# EAGLE design JouleThief-PCBCOIL (EAGLE 7.6.0)
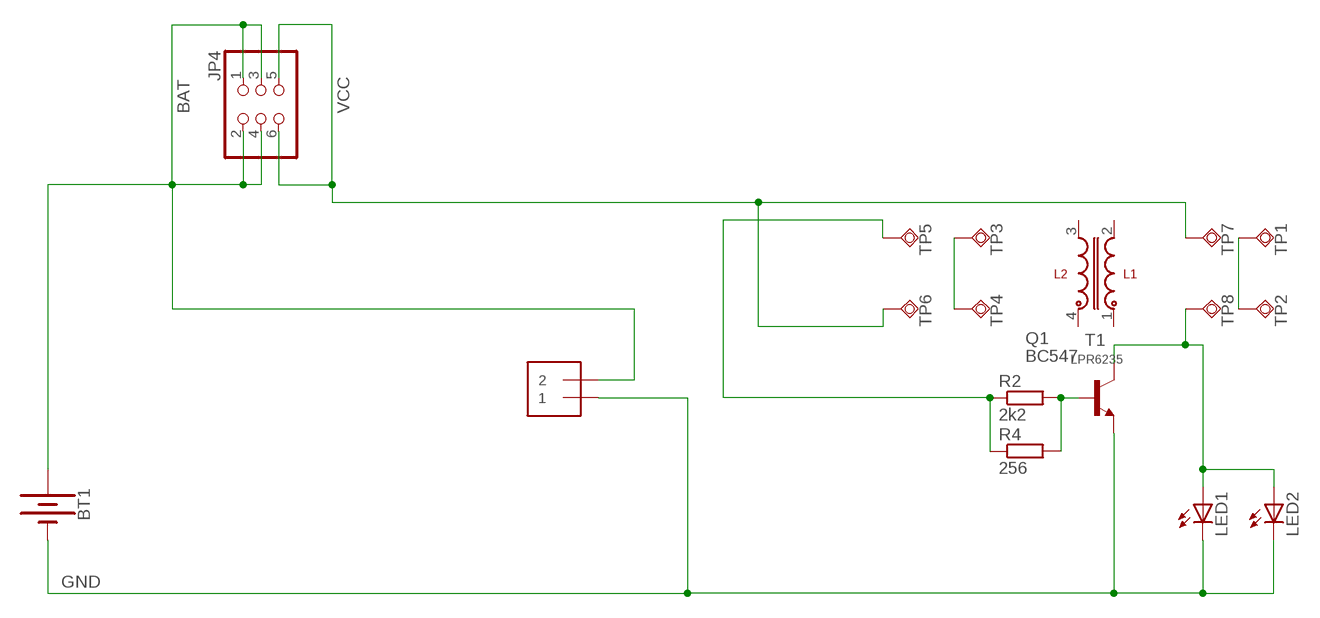
[diagram p0: schematic, sheet 1]

## Parts
BT1  BATTERY-AAA_KIT  [BATTERY-AAA-KIT]
J1  1X2-3.5MM  [1X2-3.5MM]
JP4  PINHD-2X3  [2X03]
LED1  LEDKA-3528ASYC  [KA-3528ASYC]
LED2  LED5MM  [LED5MM]
Q1  BC547  [TO92]
R2  2k2  R-EU_0204/5  [0204/5@1]
R4  256  R-EU_R0603  [R0603]
T1  LPR6235  [LPR6235]
TP1  TPSQTP07R  [TP07R]
TP2  TPSQTP07R  [TP07R]
TP3  TPSQTP07R  [TP07R]
TP4  TPSQTP07R  [TP07R]
TP5  TPSQTP07R  [TP07R]
TP6  TPSQTP07R  [TP07R]
TP7  TPSQTP07R  [TP07R]
TP8  TPSQTP07R  [TP07R]

## Nets
BAT: BT1.PWR@1(+) J1.2 JP4.1 JP4.2 JP4.3 JP4.4
GND: BT1.GND@1(-) J1.1 LED1.C LED2.K(C) Q1.1(E)
N$1: R2.1 R4.1 TP5.TP
N$2: Q1.2(B) R2.2 R4.2
N$3: LED1.A LED2.A Q1.3(C) TP8.TP
N$4: TP3.TP TP4.TP
N$5: TP1.TP TP2.TP
VCC: JP4.5 JP4.6 TP6.TP TP7.TP
Unconnected: T1.1 T1.2 T1.3 T1.4

## Library data of the parts
BT1 = SparkFun-Batteries:BATTERY: Battery - Single Cell A variety of battery chemistries, sizes, and footprints. Device List: 20MM_PTH - Coin Cell Battery Holder - 20mm (PTH) <https://www.sparkfun.com/products/783> 12MM_SMD - Coin Cell Battery Holder - 12mm (SMD) <https://www.sparkfun.com/products/10592> 12MM_PTH - Coin Cell Battery Holder - 12mm (PTH) <https://www.sparkfun.com/products/7948> 20MM_SMD - 20mm Coin Cell Battery Holder (SMD) (2 legs) Used on the Big Time Watch Kit <https://www.sparkfun.com/products/11734> 20MM_SMD_4LEGS - Coin Cell Battery Holder - 20mm (SMD) <https://www.sparkfun.com/products/11892> 20MM_SMD_4LEGS_OVERPASTE - Coin Cell Battery Holder - 20mm (SMD) <https://www.sparkfun.com/products/11892> (Over-paste on the legs) 24.5MM_PTH - Coin Cell Battery Holder - 24.5mm (PTH) <https://www.sparkfun.com/products/8863> 9V - 9V Battery Holder - PC Mount Used on the SparkFun SparkPunk Sound Kit <https://www.sparkfun.com/products/11177> and SparkFun SparkPunk Sequencer Kit <https://www.sparkfun.com/products/12707> 18650 - Battery Holder - 18650 (PTH) <https://www.sparkfun.com/products/13113> AA - Battery Holder - 1xAA (PTH) <https://www.sparkfun.com/products/7949> AAA - Battery Holder - 1xAAA (PTH) <https://www.sparkfun.com/products/12718> AA_KIT - Battery Holder - 1xAA (PTH) <https://www.sparkfun.com/products/7949> Special kit package - pads only have exposed copper on one side of the board. AAA_KIT - Battery Holder - 1xAAA (PTH) <https://www.sparkfun.com/products/12718> Special kit package - pads only have exposed copper on one side of the board.; PROD_ID: BATT-08571; SF_SKU: PRT-12718
J1 = adafruit:1X2: 3.5mm Terminal block http://www.ladyada.net/library/pcb/eaglelibrary.html
JP4 = pinhead:PINHD-2X3: PIN HEADER
LED1 LED2 = led:LED: LED OSRAM: - CHIPLED LG R971, LG N971, LY N971, LG Q971, LY Q971, LO R971, LY R971 LH N974, LH R974 LS Q976, LO Q976, LY Q976 LO Q996 - Hyper CHIPLED LW Q18S LB Q993, LB Q99A, LB R99A - SideLED LS A670, LO A670, LY A670, LG A670, LP A670 LB A673, LV A673, LT A673, LW A673 LH A674 LY A675 LS A676, LA A676, LO A676, LY A676, LW A676 LS A679, LY A679, LG A679 - Hyper Micro SIDELED® LS Y876, LA Y876, LO Y876, LY Y876 LT Y87S - SmartLED LW L88C, LW L88S LB L89C, LB L89S, LG L890 LS L89K, LO L89K, LY L89K LS L896, LA L896, LO L896, LY L896 - TOPLED LS T670, LO T670, LY T670, LG T670, LP T670 LSG T670, LSP T670, LSY T670, LOP T670, LYG T670 LG T671, LOG T671, LSG T671 LB T673, LV T673, LT T673, LW T673 LH T674 LS T676, LA T676, LO T676, LY T676, LB T676, LH T676, LSB T676, LW T676 LB T67C, LV T67C, LT T67C, LS T67K, LO T67K, LY T67K, LW E67C LS E67B, LA E67B, LO E67B, LY E67B, LB E67C, LV E67C, LT E67C LW T67C LS T679, LY T679, LG T679 LS T770, LO T770, LY T770, LG T770, LP T770 LB T773, LV T773, LT T773, LW T773 LH T774 LS E675, LA E675, LY E675, LS T675 LS T776, LA T776, LO T776, LY T776, LB T776 LHGB T686 LT T68C, LB T68C - Hyper Mini TOPLED® LB M676 - Mini TOPLED Santana® LG M470 LS M47K, LO M47K, LY M47K Source: http://www.osram.convergy.de LUXEON: - LUMILED® LXK2-PW12-R00, LXK2-PW12-S00, LXK2-PW14-U00, LXK2-PW14-V00 LXK2-PM12-R00, LXK2-PM12-S00, LXK2-PM14-U00 LXK2-PE12-Q00, LXK2-PE12-R00, LXK2-PE12-S00, LXK2-PE14-T00, LXK2-PE14-U00 LXK2-PB12-K00, LXK2-PB12-L00, LXK2-PB12-M00, LXK2-PB14-N00, LXK2-PB14-P00, LXK2-PB14-Q00 LXK2-PR12-L00, LXK2-PR12-M00, LXK2-PR14-Q00, LXK2-PR14-R00 LXK2-PD12-Q00, LXK2-PD12-R00, LXK2-PD12-S00 LXK2-PH12-R00, LXK2-PH12-S00 LXK2-PL12-P00, LXK2-PL12-Q00, LXK2-PL12-R00 Source: www.luxeon.com KINGBRIGHT: KA-3528ASYC Source: www.kingbright.com
Q1 = transistor-npn:BC547*: NPN Transistor
R2 = rcl:R-EU_: RESISTOR, European symbol
R4 = resistor:R-EU_: RESISTOR, European symbol
T1 = umich:LPR6235
TP1-TP8 = testpad:TPSQ: Test pad

## Net classes
0 default: width 0.381 mm, drill 0.356 mm, clearance 0.254 mm
1 GND: width 0.381 mm, drill 0.356 mm, clearance 0.254 mm
2 pwr: width 0.381 mm, drill 0.356 mm, clearance 0.254 mm

## Board
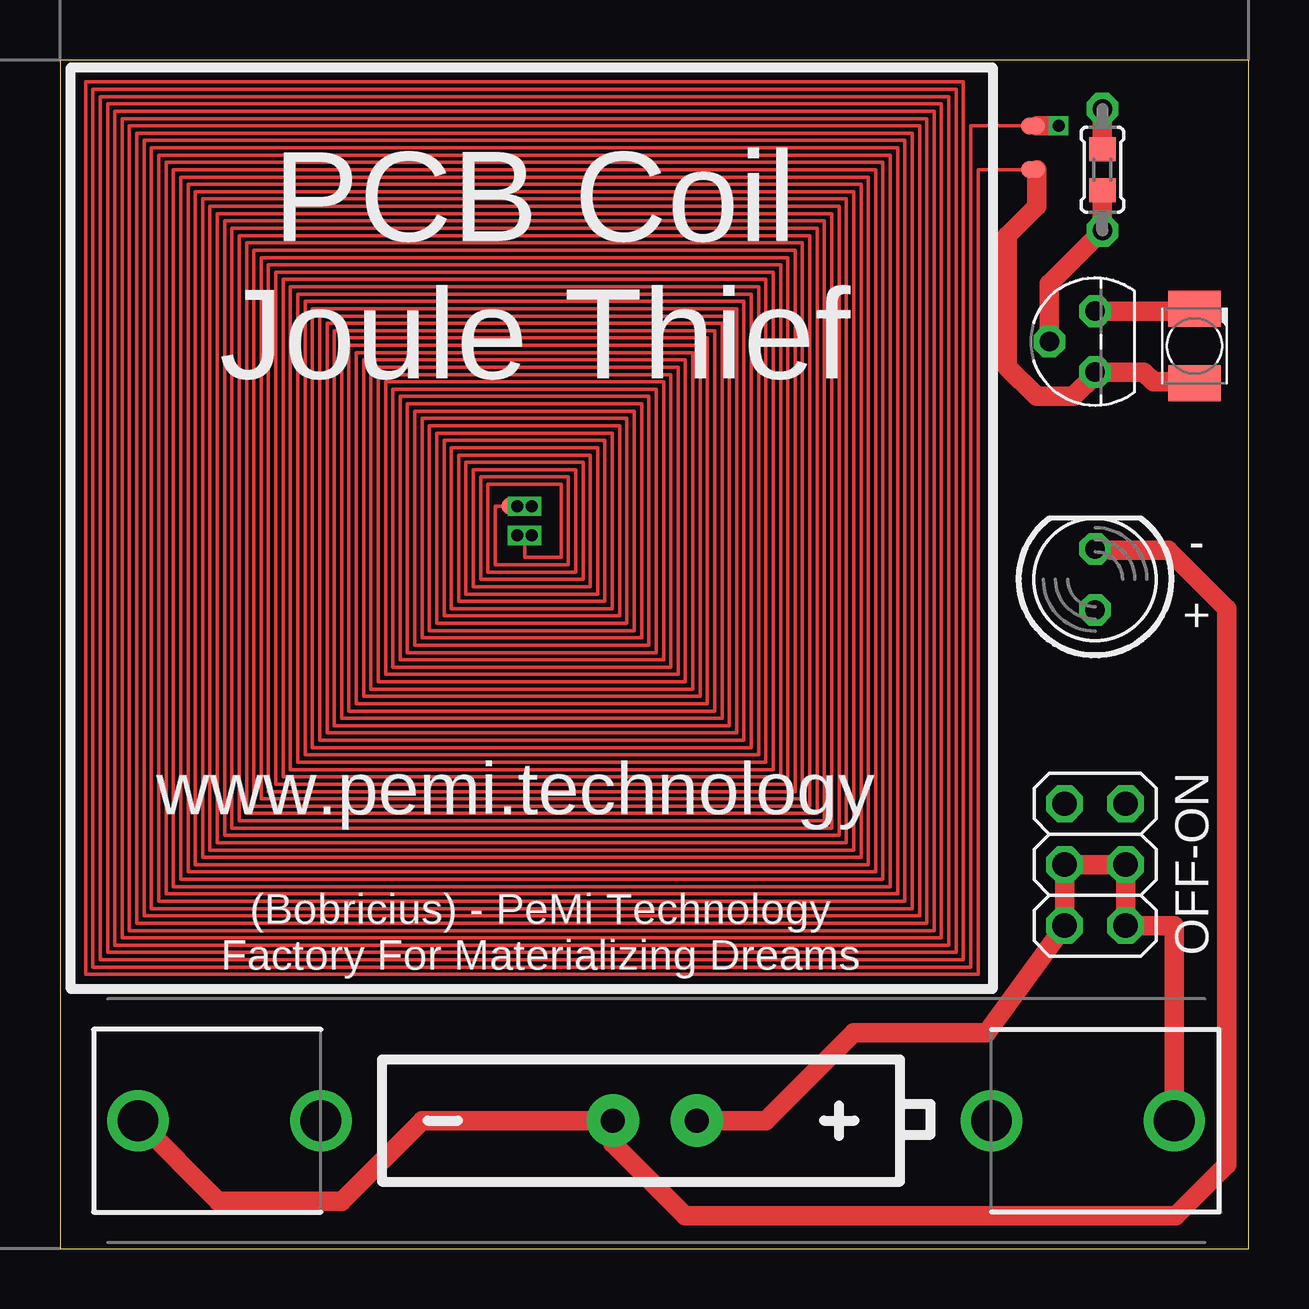
[diagram p1: board, top side]
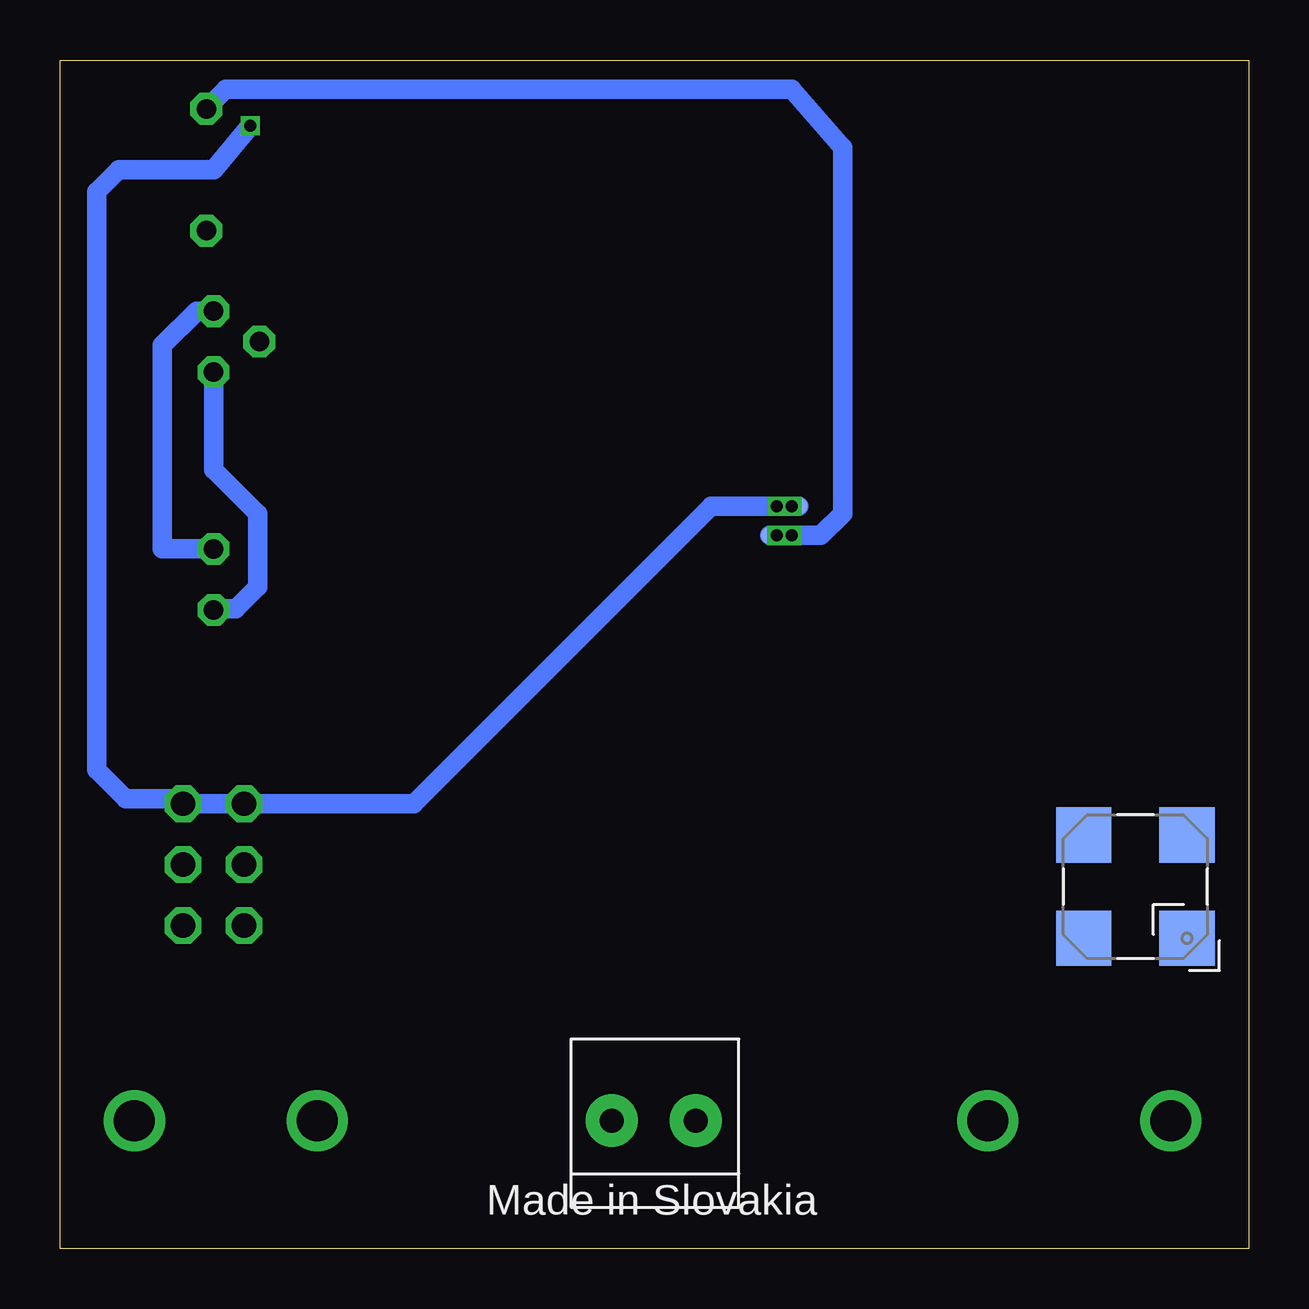
[diagram p2: board, bottom side, seen from below]

Size 49.53 x 49.53 mm. Coordinates in mm from the lower left corner, seen from the top.
Outline: 49.53,49.53 0,49.53 0,0 49.53,0 49.53,49.53
Copper layers (1*16): Top 0.035mm / dielectric 1.5mm / Bottom 0.035mm
Design rules "ITEADstudio_DRC": minimum track width 6mil, minimum drill 12mil, track to track 6mil, track to pad 6mil, pad to pad 6mil, via to via 6mil, smd to smd 0mil, copper to edge 10mil, drill to drill 10mil, minimum pad ring 10mil, minimum via ring 6mil, stop-mask expansion 2mil, vias tented up to drill 100mil, thermal gap 10mil

### Footprints (pad centres in the part's own frame; a part is rotated, then mirrored left to right if it is on the bottom)
BATTERY-AAA-KIT = drill 1.702: GND@1 21.59,0; GND@2 13.97,0; PWR@1 -21.59,0; PWR@2 -13.97,0
1X2-3.5MM = drill 1 pad 2.184: 1 1.8,0; 2 -1.7,0
2X03 = drill 1.016 octagon: 1 -2.54,-1.27; 2 -2.54,1.27; 3 0,-1.27; 4 0,1.27; 5 2.54,-1.27; 6 2.54,1.27
KA-3528ASYC = smd 1.5 x 2.2: A -1.55,0; C 1.55,0
LED5MM = drill 0.813 octagon: A -1.27,0; K 1.27,0
TO92 = drill 0.813 octagon: 1 1.27,0; 2 0,1.905; 3 -1.27,0
0204/5@1 = drill 0.813 octagon: 1 -2.54,0; 2 2.54,0
R0603 = smd 1 x 1.1: 1 -0.85,0; 2 0.85,0
LPR6235 = smd 2.3 x 2.3: 1 -2.15,2.15; 2 -2.15,-2.15; 3 2.15,-2.15; 4 2.15,2.15
TP07R = smd 0.7 x 0.7: TP 0,0

### Placement (x,y rotation side)
BT1  24.84,5.33 180 top
J1  24.84,5.33 0 bottom
JP4  43.13,16 90 top
LED1  47.27,37.62 90 top
LED2  43.13,27.89 90 top
Q1  43.13,37.8 90 top
R2  43.43,44.96 270 top
R4  43.43,44.96 270 top
T1  4.72,15.09 180 bottom
TP1  18.75,30.94 0 top
TP2  40.39,44.96 0 top
TP3  19.35,29.72 0 top
TP4  40.39,46.79 0 top
TP5  19.96,29.72 0 bottom
TP6  40.69,46.79 0 top
TP7  18.75,30.94 0 bottom
TP8  40.69,44.96 0 top

### Tracks (layer width: path | path; a pad name or v marks a point on that pad's centre or on a via)
BAT
  Top 0.813: BT1.PWR@1 46.43,13.46 JP4.1 JP4.3 JP4.4 JP4.2 38.61,8.99 33.07,8.99 29.41,5.33 J1.2
GND
  Top 0.813: BT1.GND@1 6.6,1.98 11.73,1.98 15.09,5.33 J1.1 23.04,4.39 26.06,1.37 46.48,1.37 48.62,3.5 48.62,26.67 46.18,29.11 43.79,29.11 LED2.K | Q1.1 47.17,39.06 LED1.C
  Bottom 0.813: Q1.1 43.84,39.06 45.26,37.64 45.26,29.16 LED2.K
N$1  (via drill 0.5)
  Top 0.813: R4.1 R2.1
  Bottom 0.813: TP5.TP v19.66,29.72 v19.05,29.72 17.83,29.72 16.92,30.63 16.92,45.87 19.05,48.31 42.62,48.31 R2.1
N$2
  Top 0.813: R4.2 R2.2 41.22,40.21 Q1.2
N$3
  Top 0.813: LED1.A 47.22,36.12 45.57,36.12 45.16,36.53 Q1.3 43.13,36.42 42.22,35.51 40.69,35.51 39.47,36.73 39.47,42.22 40.69,43.43 TP8.TP
  Bottom 0.813: Q1.3 43.13,32.46 41.3,30.63 41.3,27.58 42.22,26.67 42.77,26.67 LED2.A
N$4
  Top 0.152: TP3.TP 19.36,28.8 20.88,28.8 20.88,31.85 17.83,31.85 17.83,28.19 21.49,28.19 21.49,32.46 17.22,32.46 17.22,27.58 22.1,27.58 22.1,33.07 16.61,33.07 16.61,26.97 22.71,26.97 22.71,33.68 16,33.68 16,26.36 23.32,26.36 23.32,34.29 15.39,34.29 15.39,25.76 23.93,25.76 23.93,34.9 14.78,34.9 14.78,25.15 24.54,25.15 24.54,35.51 14.17,35.51 14.17,24.54 25.15,24.54 25.15,36.12 13.56,36.12 13.56,23.93 25.76,23.93 25.76,36.73 12.95,36.73 12.95,23.32 26.37,23.32 26.37,37.34 12.34,37.34 12.34,22.71 26.98,22.71 26.98,37.95 11.73,37.95 11.73,22.1 27.58,22.1 27.58,38.56 11.12,38.56 11.12,21.49 28.19,21.49 28.19,39.17 10.52,39.17 10.52,20.88 28.8,20.88 28.8,39.78 9.91,39.78 9.91,20.27 29.41,20.27 29.41,40.39 9.3,40.39 9.3,19.66 30.02,19.66 30.02,41 8.69,41 8.69,19.05 30.63,19.05 30.63,41.61 8.08,41.61 8.08,18.44 31.24,18.44 31.24,42.22 7.47,42.22 7.47,17.83 31.85,17.83 31.85,42.82 6.86,42.82 6.86,17.22 32.46,17.22 32.46,43.43 6.25,43.43 6.25,16.61 33.07,16.61 33.07,44.04 5.64,44.04 5.64,16 33.68,16 33.68,44.65 5.03,44.65 5.03,15.39 34.29,15.39 34.29,45.26 4.42,45.26 4.42,14.78 34.9,14.78 34.9,45.87 3.81,45.87 3.81,14.17 35.51,14.17 35.51,46.48 3.2,46.48 3.2,13.56 36.12,13.56 36.12,47.09 2.59,47.09 2.59,12.95 36.73,12.95 36.73,47.7 1.98,47.7 1.98,12.34 37.34,12.34 37.34,48.31 1.37,48.31 1.37,11.73 37.95,11.73 37.95,46.79 TP4.TP
N$5
  Top 0.152: TP1.TP 18.14,30.94 18.14,28.5 21.18,28.5 21.18,32.16 17.53,32.16 17.53,27.89 21.79,27.89 21.79,32.77 16.92,32.77 16.92,27.28 22.4,27.28 22.4,33.38 16.31,33.38 16.31,26.67 23.01,26.67 23.01,33.98 15.7,33.98 15.7,26.06 23.62,26.06 23.62,34.59 15.09,34.59 15.09,25.45 24.23,25.45 24.23,35.2 14.48,35.2 14.48,24.84 24.84,24.84 24.84,35.81 13.87,35.81 13.87,24.23 25.45,24.23 25.45,36.42 13.26,36.42 13.26,23.62 26.06,23.62 26.06,37.03 12.65,37.03 12.65,23.01 26.67,23.01 26.67,37.64 12.04,37.64 12.04,22.4 27.28,22.4 27.28,38.25 11.43,38.25 11.43,21.79 27.89,21.79 27.89,38.86 10.82,38.86 10.82,21.18 28.5,21.18 28.5,39.47 10.21,39.47 10.21,20.57 29.11,20.57 29.11,40.08 9.6,40.08 9.6,19.96 29.72,19.96 29.72,40.69 8.99,40.69 8.99,19.36 30.33,19.36 30.33,41.3 8.38,41.3 8.38,18.75 30.94,18.75 30.94,41.91 7.77,41.91 7.77,18.14 31.55,18.14 31.55,42.52 7.16,42.52 7.16,17.53 32.16,17.53 32.16,43.13 6.55,43.13 6.55,16.92 32.77,16.92 32.77,43.74 5.94,43.74 5.94,16.31 33.38,16.31 33.38,44.35 5.33,44.35 5.33,15.7 33.98,15.7 33.98,44.96 4.72,44.96 4.72,15.09 34.59,15.09 34.59,45.57 4.12,45.57 4.12,14.48 35.2,14.48 35.2,46.18 3.51,46.18 3.51,13.87 35.81,13.87 35.81,46.79 2.9,46.79 2.9,13.26 36.42,13.26 36.42,47.4 2.29,47.4 2.29,12.65 37.03,12.65 37.03,48.01 1.68,48.01 1.68,12.04 37.64,12.04 37.64,48.62 1.07,48.62 1.07,11.43 38.25,11.43 38.25,44.96 TP2.TP
VCC  (via drill 0.5)
  Top 0.813: TP6.TP v41.61,46.79
  Bottom 0.813: TP7.TP v19.05,30.94 v19.66,30.94 22.4,30.94 34.8,18.54 JP4.6 JP4.5 44.6,18.75 46.79,18.75 48.01,19.96 48.01,44.04 47.09,44.96 43.13,44.96 v41.61,46.79

### Text on the board
tNames: PCB Coil / Joule Thief | - | + | www.pemi.technology | OFF-ON | (Bobricius) - PeMi Technology / Factory For Materializing Dreams
bNames: Made in Slovakia